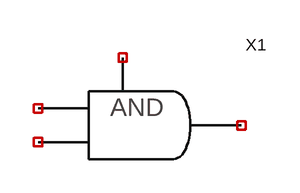
[diagram p0: schematic Draft6.asc]
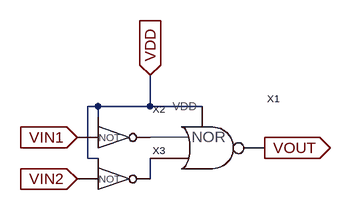
[diagram p1: sub-circuit and.asc]
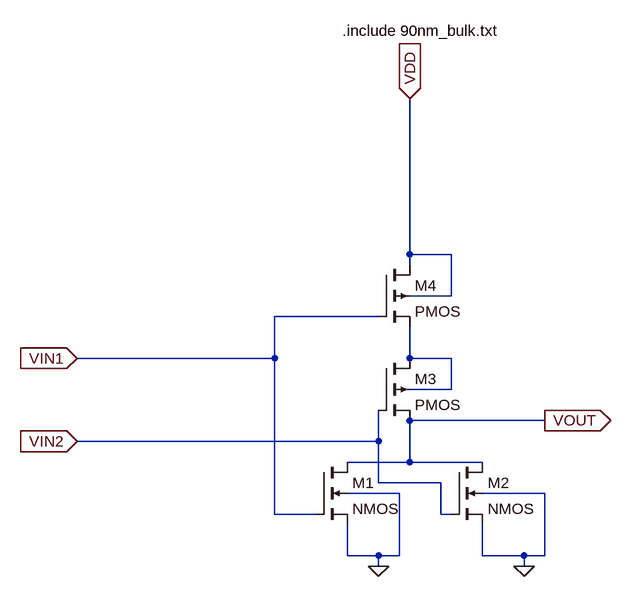
[diagram p2: sub-circuit nor.asc]
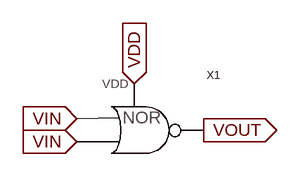
[diagram p3: sub-circuit not.asc]
Draft6.asc, the LTspice schematic file:
Version 4
SHEET 1 880 680
SYMBOL AND 336 144 R0
SYMATTR InstName X1

and.asc, the sub-circuit schematic file:
Version 4
SHEET 1 880 680
WIRE 48 96 32 96
WIRE 128 96 128 48
WIRE 128 96 48 96
WIRE 208 96 128 96
WIRE 48 112 48 96
WIRE 32 176 32 96
WIRE 48 176 32 176
WIRE 128 208 128 176
FLAG 16 144 VIN1
IOPIN 16 144 In
FLAG 16 208 VIN2
IOPIN 16 208 In
FLAG 128 48 VDD
IOPIN 128 48 In
FLAG 304 160 VOUT
IOPIN 304 160 Out
SYMBOL NOR 208 160 R0
SYMATTR InstName X1
SYMBOL NOT 80 144 R0
SYMATTR InstName X2
SYMBOL NOT 80 208 R0
SYMATTR InstName X3

nor.asc, the sub-circuit schematic file:
Version 4
SHEET 1 880 680
WIRE 336 -32 336 -272
WIRE 400 -32 336 -32
WIRE 336 -16 336 -32
WIRE 400 32 400 -32
WIRE 400 32 336 32
WIRE 288 64 128 64
WIRE 128 128 128 64
WIRE 128 128 -176 128
WIRE 336 128 336 80
WIRE 400 128 336 128
WIRE 400 176 400 128
WIRE 400 176 336 176
WIRE 336 224 336 208
WIRE 544 224 336 224
WIRE 288 256 288 208
WIRE 288 256 -176 256
WIRE 336 288 336 224
WIRE 336 288 240 288
WIRE 448 288 336 288
WIRE 288 320 288 256
WIRE 384 320 288 320
WIRE 320 336 240 336
WIRE 544 336 448 336
WIRE 128 368 128 128
WIRE 192 368 128 368
WIRE 384 368 384 320
WIRE 400 368 384 368
WIRE 240 432 240 384
WIRE 288 432 240 432
WIRE 320 432 320 336
WIRE 320 432 288 432
WIRE 448 432 448 384
WIRE 512 432 448 432
WIRE 544 432 544 336
WIRE 544 432 512 432
WIRE 288 448 288 432
WIRE 512 448 512 432
FLAG 288 448 0
FLAG 512 448 0
FLAG 544 224 VOUT
IOPIN 544 224 Out
FLAG -176 128 VIN1
IOPIN -176 128 In
FLAG -176 256 VIN2
IOPIN -176 256 In
FLAG 336 -272 VDD
IOPIN 336 -272 In
SYMBOL nmos4 192 288 R0
SYMATTR InstName M1
SYMATTR Value2 l=90n w=200n
SYMBOL nmos4 400 288 R0
SYMATTR InstName M2
SYMATTR Value2 l=90n w=200n
SYMBOL pmos4 288 128 R0
SYMATTR InstName M3
SYMATTR Value2 l=90n w=400n
SYMBOL pmos4 288 -16 R0
SYMATTR InstName M4
SYMATTR Value2 l=90n w=400n
TEXT 232 -376 Left 2 !.include 90nm_bulk.txt

not.asc, the sub-circuit schematic file:
Version 4
SHEET 1 880 680
FLAG 112 176 VIN
IOPIN 112 176 In
FLAG 112 208 VIN
IOPIN 112 208 In
FLAG 288 192 VOUT
IOPIN 288 192 Out
FLAG 192 128 VDD
IOPIN 192 128 In
SYMBOL NOR 192 192 R0
SYMATTR InstName X1

The netlist it stands for:
* Draft6.asc
XX1 NC_01 NC_02 NC_03 NC_04 and

* block symbol definitions
.subckt and VDD VIN1 VIN2 VOUT
XX1 P001 N001 VDD VOUT nor
XX2 VDD VIN1 P001 not
XX3 VDD VIN2 N001 not
.ends and

.subckt nor VIN1 VIN2 VDD VOUT
M1 VOUT VIN1 0 0 NMOS l=90n w=200n
M2 VOUT VIN2 0 0 NMOS l=90n w=200n
M3 N001 VIN2 VOUT N001 PMOS l=90n w=400n
M4 VDD VIN1 N001 VDD PMOS l=90n w=400n
.include 90nm_bulk.txt
.ends nor

.subckt not VDD VIN VOUT
XX1 VIN VIN VDD VOUT nor
.ends not

.model NMOS NMOS
.model PMOS PMOS
.lib standard.mos
.backanno
.end